# Altium project rpi fan control.PrjPcb
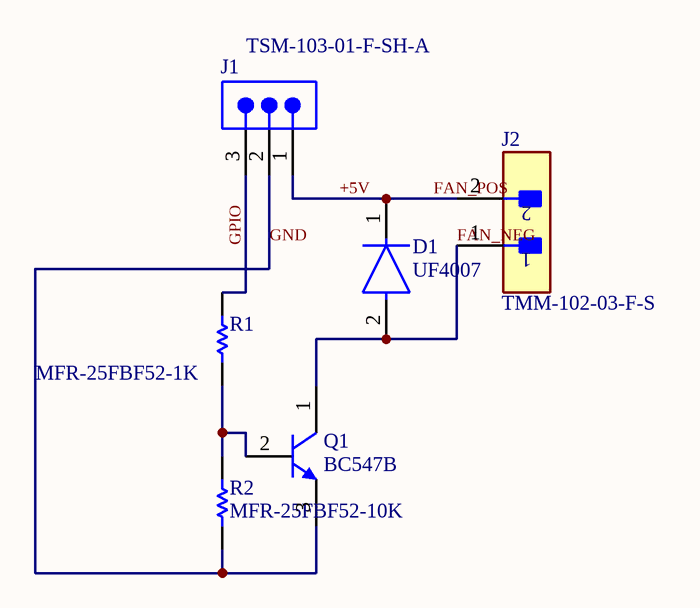
[diagram p0: rpi fan control.SchDoc]
1 sheet, 6 parts. Net scope: global (net labels, ports and power ports of the same name join across sheets).
Board file: PCB1.PcbDoc

## Sheet rpi fan control.SchDoc
size A; SheetNumber: 1; SheetTotal: 1

### Parts
D1  UF4007
J1  TSM-103-01-F-SH-A
J2  TMM-102-03-F-S
Q1  BC547B
R1  MFR-25FBF52-1K
R2  MFR-25FBF52-10K

### Nets
+5V: D1.1(C) J1.1 J2.2  [also labelled FAN_POS]
FAN_NEG: D1.2(A) J2.1 Q1.1(C)
GND: J1.2 Q1.3(E) R2.1
GPIO: J1.3 R1.1
NetQ1_2: Q1.2(B) R1.2 R2.2

### Library data of the parts
D1 = UF4007: Diode Ultra Fast Recovery Rectifier 1K Volt 1A 2-Pin DO-41 Tape and Reel; Manufacturer: onsemi; Manufacturer Lifecycle Status: ACTIVE; Value: 17pF; Element Configuration: Single; Forward Voltage: 1.4V; Max Forward Surge Current (Ifsm): 30A; Max Junction Temperature (Tj): 150°C; Max Power Dissipation: 2.08W; Max Repetitive Reverse Voltage (Vrrm): 1kV; Number of Elements: 1; Peak Reverse Current: 5µA; Polarity: Standard; Recovery Time: 75ns; Supplier: DigiKey; Supplier Part Number: UF4007CT-ND; Manufacturer Part Number: UF4007; RoHS: Compliant; Category: Rectifier Diodes; Stock: 17870; Pricing: 1=0.35, 10=0.218, 100=0.1797, 500=0.13446, 1000=0.11633, 2000=0.10752 (USD); Average Rectified Current: 1A; Case/Package: Axial; China RoHS: Non-Compliant; Contact Plating: Tin; Current: 1A; Current Rating: 1A; Forward Current: 1A; Height: 2.72mm; Lead Free: Lead Free; Length: 5.21mm; Lifecycle Status: Production; Max Operating Temperature: 150°C; Max Output current: 1A; Max Reverse Voltage (DC): 1kV; Max Surge Current: 30A; Min Operating Temperature: -65°C; Mounting Technology: Through Hole; Pins: 2; Number of Terminals: 2; Output Current: 1A; Packaging: Cut Tape; Peak Non-Repetitive Surge Current: 30A; Power Dissipation: 2.08W; Radiation Hardening: No; REACH SVHC: No; Reverse Recovery Time: 75ns; Reverse Standoff Voltage: 1kV; Reverse Voltage: 1kV; Schedule B: 8541100080, 8541100080|8541100080|8541100080|8541100080|8541100080; Voltage: 1kV; Voltage Rating (DC): 1kV; Weight: 4.535924g; Width: 2.72mm; ComponentLink1URL: https://datasheet.octopart.com:443/UF4007-onsemi-datasheet-180969923.pdf?src-supplier=IHS; ComponentLink1Description: https://datasheet.octopart.com:443/UF4007-onsemi-datasheet-180969923.pdf?src-supplier=IHS; ComponentLink2URL: https://datasheet.octopart.com:443/UF4007-onsemi-datasheet-181265948.pdf?src-supplier=IHS; ComponentLink2Description: https://datasheet.octopart.com:443/UF4007-onsemi-datasheet-181265948.pdf?src-supplier=IHS; ComponentLink3URL: https://datasheet.octopart.com:443/UF4007-Fairchild-Semiconductor-datasheet-182301099.pdf?src-supplier=IHS; ComponentLink3Description: https://datasheet.octopart.com:443/UF4007-Fairchild-Semiconductor-datasheet-182301099.pdf?src-supplier=IHS; ComponentLink4URL: https://datasheet.octopart.com:443/UF4007-ON-Semiconductor-datasheet-137256446.pdf?src-supplier=Farnell; ComponentLink4Description: https://datasheet.octopart.com:443/UF4007-ON-Semiconductor-datasheet-137256446.pdf?src-supplier=Farnell; ComponentLink5URL: https://datasheet.octopart.com:443/UF4007.-Fairchild-Semiconductor-datasheet-34433558.pdf?src-supplier=Farnell; ComponentLink5Description: https://datasheet.octopart.com:443/UF4007.-Fairchild-Semiconductor-datasheet-34433558.pdf?src-supplier=Farnell; ComponentLink6URL: https://datasheet.octopart.com:443/UF4007.-Fairchild-Semiconductor-datasheet-37002497.pdf?src-supplier=Farnell; ComponentLink6Description: https://datasheet.octopart.com:443/UF4007.-Fairchild-Semiconductor-datasheet-37002497.pdf?src-supplier=Farnell; ComponentLink7URL: https://datasheet.octopart.com:443/UF4007-Fairchild-Semiconductor-datasheet-41918660.pdf?src-supplier=Farnell; ComponentLink7Description: https://datasheet.octopart.com:443/UF4007-Fairchild-Semiconductor-datasheet-41918660.pdf?src-supplier=Farnell; ComponentLink8URL: https://sigma.octopart.com:443/138897246/technical_drawing/ON-Semiconductor-UF4007.pdf?src-supplier=Upverter; ComponentLink8Description: https://sigma.octopart.com:443/138897246/technical_drawing/ON-Semiconductor-UF4007.pdf?src-supplier=Upverter; ComponentLink9URL: https://datasheet.octopart.com:443/UF4007-ON-Semiconductor-datasheet-85608470.pdf?src-supplier=onsemi; ComponentLink9Description: https://datasheet.octopart.com:443/UF4007-ON-Semiconductor-datasheet-85608470.pdf?src-supplier=onsemi; ComponentLink10URL: https://datasheet.octopart.com:443/UF4007-ON-Semiconductor-datasheet-86698774.pdf?src-supplier=onsemi; ComponentLink10Description: https://datasheet.octopart.com:443/UF4007-ON-Semiconductor-datasheet-86698774.pdf?src-supplier=onsemi; ComponentLink11URL: https://datasheet.octopart.com:443/UF4007-ON-Semiconductor-datasheet-35217.pdf?src-supplier=Future+Electronics; ComponentLink11Description: https://datasheet.octopart.com:443/UF4007-ON-Semiconductor-datasheet-35217.pdf?src-supplier=Future+Electronics; ComponentLink12URL: https://datasheet.octopart.com:443/UF4007-ON-Semiconductor-datasheet-86693217.pdf?src-supplier=element14+APAC; ComponentLink12Description: https://datasheet.octopart.com:443/UF4007-ON-Semiconductor-datasheet-86693217.pdf?src-supplier=element14+APAC; ComponentLink13URL: https://datasheet.octopart.com:443/UF4007-Fairchild-Semiconductor-datasheet-38930020.pdf?src-supplier=element14+APAC; ComponentLink13Description: https://datasheet.octopart.com:443/UF4007-Fairchild-Semiconductor-datasheet-38930020.pdf?src-supplier=element14+APAC; ComponentLink14URL: https://datasheet.octopart.com:443/UF4007.-Fairchild-Semiconductor-datasheet-33335970.pdf?src-supplier=Newark; ComponentLink14Description: https://datasheet.octopart.com:443/UF4007.-Fairchild-Semiconductor-datasheet-33335970.pdf?src-supplier=Newark; ComponentLink15URL: https://datasheet.octopart.com:443/UF4007-ON-Semiconductor-datasheet-86693216.pdf?src-supplier=Newark; ComponentLink15Description: https://datasheet.octopart.com:443/UF4007-ON-Semiconductor-datasheet-86693216.pdf?src-supplier=Newark; ComponentLink16URL: https://datasheet.octopart.com:443/UF4007.-Fairchild-Semiconductor-datasheet-34214984.pdf?src-supplier=Newark; ComponentLink16Description: https://datasheet.octopart.com:443/UF4007.-Fairchild-Semiconductor-datasheet-34214984.pdf?src-supplier=Newark; ComponentLink17URL: https://datasheet.octopart.com:443/UF4007-Fairchild-Semiconductor-datasheet-38206202.pdf?src-supplier=Newark; ComponentLink17Description: https://datasheet.octopart.com:443/UF4007-Fairchild-Semiconductor-datasheet-38206202.pdf?src-supplier=Newark; ComponentLink18URL: https://datasheet.octopart.com:443/UF4007-Fairchild-Semiconductor-datasheet-38327715.pdf?src-supplier=Newark; ComponentLink18Description: https://datasheet.octopart.com:443/UF4007-Fairchild-Semiconductor-datasheet-38327715.pdf?src-supplier=Newark; ComponentLink19URL: https://datasheet.octopart.com:443/UF4007-Fairchild-Semiconductor-datasheet-41198808.pdf?src-supplier=Newark; ComponentLink19Description: https://datasheet.octopart.com:443/UF4007-Fairchild-Semiconductor-datasheet-41198808.pdf?src-supplier=Newark; ComponentLink20URL: https://sigma.octopart.com:443/17343399/technical_drawing/Fairchild-Semiconductor-UF4007..pdf?src-supplier=Fairchild+Semiconductor; ComponentLink20Description: https://sigma.octopart.com:443/17343399/technical_drawing/Fairchild-Semiconductor-UF4007..pdf?src-supplier=Fairchild+Semiconductor; ComponentLink21URL: https://datasheet.octopart.com:443/UF4007.-Fairchild-Semiconductor-datasheet-8212723.pdf?src-supplier=Jameco; ComponentLink21Description: https://datasheet.octopart.com:443/UF4007.-Fairchild-Semiconductor-datasheet-8212723.pdf?src-supplier=Jameco; ComponentLink22URL: https://datasheet.octopart.com:443/UF4007-ON-Semiconductor-datasheet-81456509.pdf?src-supplier=TME; ComponentLink22Description: https://datasheet.octopart.com:443/UF4007-ON-Semiconductor-datasheet-81456509.pdf?src-supplier=TME; ComponentLink23URL: https://datasheet.octopart.com:443/UF4007-Fairchild-Semiconductor-datasheet-62139681.pdf?src-supplier=iodParts+Technologies+Inc.; ComponentLink23Description: https://datasheet.octopart.com:443/UF4007-Fairchild-Semiconductor-datasheet-62139681.pdf?src-supplier=iodParts+Technologies+Inc.; ComponentLink24URL: http://sigma.octopart.com:80/150633077/rohs_statement/ON-Semiconductor-UF4007.pdf?src-supplier=Compliance+Statements; ComponentLink24Description: http://sigma.octopart.com:80/150633077/rohs_statement/ON-Semiconductor-UF4007.pdf?src-supplier=Compliance+Statements; ComponentLink25URL: http://sigma.octopart.com:80/17357661/reach_statement/Fairchild-Semiconductor-UF4007..pdf?src-supplier=Compliance+Statements; ComponentLink25Description: http://sigma.octopart.com:80/17357661/reach_statement/Fairchild-Semiconductor-UF4007..pdf?src-supplier=Compliance+Statements; ComponentLink26URL: http://sigma.octopart.com:80/17357662/materials_sheet/Fairchild-Semiconductor-UF4007..pdf?src-supplier=Compliance+Statements; ComponentLink26Description: http://sigma.octopart.com:80/17357662/materials_sheet/Fairchild-Semiconductor-UF4007..pdf?src-supplier=Compliance+Statements; ComponentLink27URL: http://sigma.octopart.com:80/33335989/reach_statement/Fairchild-Semiconductor-UF4007..pdf?src-supplier=Compliance+Statements; ComponentLink27Description: http://sigma.octopart.com:80/33335989/reach_statement/Fairchild-Semiconductor-UF4007..pdf?src-supplier=Compliance+Statements; ComponentLink28URL: http://sigma.octopart.com:80/33336027/materials_sheet/Fairchild-Semiconductor-UF4007..pdf?src-supplier=Compliance+Statements; ComponentLink28Description: http://sigma.octopart.com:80/33336027/materials_sheet/Fairchild-Semiconductor-UF4007..pdf?src-supplier=Compliance+Statements; ComponentLink29URL: http://sigma.octopart.com:80/reach_statement/ON-Semiconductor-company-79.pdf?src-supplier=Compliance+Statements; ComponentLink29Description: http://sigma.octopart.com:80/reach_statement/ON-Semiconductor-company-79.pdf?src-supplier=Compliance+Statements; ComponentLink30URL: http://sigma.octopart.com:80/rohs_statement/Fairchild-Semiconductor-company-11.pdf?src-supplier=Compliance+Statements; ComponentLink30Description: http://sigma.octopart.com:80/rohs_statement/Fairchild-Semiconductor-company-11.pdf?src-supplier=Compliance+Statements; ComponentLink31URL: http://sigma.octopart.com:80/rohs_statement/Fairchild-Semiconductor-company-10.pdf?src-supplier=Compliance+Statements; ComponentLink31Description: http://sigma.octopart.com:80/rohs_statement/Fairchild-Semiconductor-company-10.pdf?src-supplier=Compliance+Statements; ComponentLink32URL: http://sigma.octopart.com:80/reach_statement/Fairchild-Semiconductor-company-9.pdf?src-supplier=Compliance+Statements; ComponentLink32Description: http://sigma.octopart.com:80/reach_statement/Fairchild-Semiconductor-company-9.pdf?src-supplier=Compliance+Statements; ComponentLink33URL: https://octopart.com:443/opatz8j6/c1?t=eBWi3UUDGAOWFAqEZOdA6oGm2AXOLrg4WxmQ-w_-wOEfa_rUbLyaLzAMVTg5HN78kEsMDniv2Lbh3obgR6rwPPp8dABxS3d6o2eqYDO8o3gMdapd2Rz3U4Mz8uS4ECJ1wafDFTz_65bgIKqX5oG7KF8I7PBHVtR1XUau5h1NjsLN3h1M0Jzpf67G8G6cILdPvCoBrpMUjE6xXh3cMGaw-don7DWhZHICqt9ePpoxbFkS_y6cEvLn0fXWfL4eOTY-h66YpHbTIq3expYducgtuDtGA6p5zTq8haaiylq-T88WtL3tbmbvqedxrAFAZm-pmqbkhzdklXLIcmbo59_OYdA2n3lHF4hlmg&src-supplier=Compliance+Statements; ComponentLink33Description: https://octopart.com:443/opatz8j6/c1?t=eBWi3UUDGAOWFAqEZOdA6oGm2AXOLrg4WxmQ-w_-wOEfa_rUbLyaLzAMVTg5HN78kEsMDniv2Lbh3obgR6rwPPp8dABxS3d6o2eqYDO8o3gMdapd2Rz3U4Mz8uS4ECJ1wafDFTz_65bgIKqX5oG7KF8I7PBHVtR1XUau5h1NjsLN3h1M0Jzpf67G8G6cILdPvCoBrpMUjE6xXh3cMGaw-don7DWhZHICqt9ePpoxbFkS_y6cEvLn0fXWfL4eOTY-h66YpHbTIq3expYducgtuDtGA6p5zTq8haaiylq-T88WtL3tbmbvqedxrAFAZm-pmqbkhzdklXLIcmbo59_OYdA2n3lHF4hlmg&src-supplier=Compliance+Statements; ComponentLink34URL: https://octopart.com:443/opatz8j6/c1?t=a42jYeVJTD_Q6kJzO2WDpitc7EMEcKIEE4CmmV2eWJITApz43YWqo8baqaNLRCWKInwy-Kj54W9EQvVUslM8Jofv5nM44dMi8FQsB0icMd-Vvjmgv34zUkzXdyPtb0v_1mo3Km8R-PiTpVF7WkQnYyDRzI5yieaaMIcbHK5up9cBwLojC9EXvKKy8JZDDw2fEoGbyuxmXZkyHfgNwwzKXEmFCkViaW-vFHqss7ouPJRdbZ_Sf5Cy7QtFYnE8D4OuCrLObsJtEPkd95m40-WkOQk-n86xMyx9EqQ8aYfKqWrnbdJUEuOUyJ6iDZ2Mhpv8GXLnmFbPD6yJZ3HMrv7pfMPsDpiosL8lPLg&src-supplier=Compliance+Statements; ComponentLink34Description: https://octopart.com:443/opatz8j6/c1?t=a42jYeVJTD_Q6kJzO2WDpitc7EMEcKIEE4CmmV2eWJITApz43YWqo8baqaNLRCWKInwy-Kj54W9EQvVUslM8Jofv5nM44dMi8FQsB0icMd-Vvjmgv34zUkzXdyPtb0v_1mo3Km8R-PiTpVF7WkQnYyDRzI5yieaaMIcbHK5up9cBwLojC9EXvKKy8JZDDw2fEoGbyuxmXZkyHfgNwwzKXEmFCkViaW-vFHqss7ouPJRdbZ_Sf5Cy7QtFYnE8D4OuCrLObsJtEPkd95m40-WkOQk-n86xMyx9EqQ8aYfKqWrnbdJUEuOUyJ6iDZ2Mhpv8GXLnmFbPD6yJZ3HMrv7pfMPsDpiosL8lPLg&src-supplier=Compliance+Statements
J1 = TSM-103-01-F-SH-A: Conn Unshrouded Header HDR 3 POS 2.54mm Solder RA SMD Tube; Manufacturer: Samtec; Manufacturer Lifecycle Status: PRODUCTION; Gender: Male; Number of Contacts: 3; Supplier: Mouser; Supplier Part Number: 200-TSM10301FSHA; Manufacturer Part Number: TSM-103-01-F-SH-A; RoHS: Compliant; Category: Headers and Wire Housings; Stock: 346; Pricing: 1=1, 10=1, 50=0.832, 100=0.832, 1000=0.579, 10000=0.432 (USD); Contact Plating: Gold; Lead Free: Lead Free; Lifecycle Status: Production; Max Operating Temperature: 125°C; Min Operating Temperature: -55°C; Number of Rows: 1; Orientation: Horizontal; Packaging: Bulk; Pitch: 2.54mm; Radiation Hardening: No; Termination: Solder; ComponentLink1URL: https://datasheet.octopart.com:443/TSM-103-01-F-SH-A-Samtec-datasheet-97319594.pdf?src-supplier=Sager+Electronics; ComponentLink1Description: https://datasheet.octopart.com:443/TSM-103-01-F-SH-A-Samtec-datasheet-97319594.pdf?src-supplier=Sager+Electronics; ComponentLink2URL: https://datasheet.octopart.com:443/TSM-103-01-F-SH-A-Samtec-datasheet-155753699.pdf?src-supplier=Sager+Electronics; ComponentLink2Description: https://datasheet.octopart.com:443/TSM-103-01-F-SH-A-Samtec-datasheet-155753699.pdf?src-supplier=Sager+Electronics; ComponentLink3URL: https://datasheet.octopart.com:443/TSM-103-01-F-SH-A-Samtec-datasheet-151555687.pdf?src-supplier=Sager+Electronics; ComponentLink3Description: https://datasheet.octopart.com:443/TSM-103-01-F-SH-A-Samtec-datasheet-151555687.pdf?src-supplier=Sager+Electronics; ComponentLink4URL: https://datasheet.octopart.com:443/TSM-103-01-F-SH-A-Samtec-datasheet-12008796.pdf?src-supplier=Upverter; ComponentLink4Description: https://datasheet.octopart.com:443/TSM-103-01-F-SH-A-Samtec-datasheet-12008796.pdf?src-supplier=Upverter; ComponentLink5URL: https://datasheet.octopart.com:443/TSM-103-01-F-SH-A-Samtec-datasheet-10407325.pdf?src-supplier=Upverter; ComponentLink5Description: https://datasheet.octopart.com:443/TSM-103-01-F-SH-A-Samtec-datasheet-10407325.pdf?src-supplier=Upverter; ComponentLink6URL: https://sigma.octopart.com:443/97319599/technical_drawing/Samtec-TSM-103-01-F-SH-A.pdf?src-supplier=Samtec; ComponentLink6Description: https://sigma.octopart.com:443/97319599/technical_drawing/Samtec-TSM-103-01-F-SH-A.pdf?src-supplier=Samtec; ComponentLink7URL: https://datasheet.octopart.com:443/TSM-103-01-F-SH-A-Samtec-datasheet-141160580.pdf?src-supplier=Electro+Sonic; ComponentLink7Description: https://datasheet.octopart.com:443/TSM-103-01-F-SH-A-Samtec-datasheet-141160580.pdf?src-supplier=Electro+Sonic; ComponentLink8URL: https://datasheet.octopart.com:443/TSM-103-01-F-SH-A-Samtec-datasheet-179063997.pdf?src-supplier=JRH+Electronics; ComponentLink8Description: https://datasheet.octopart.com:443/TSM-103-01-F-SH-A-Samtec-datasheet-179063997.pdf?src-supplier=JRH+Electronics; ComponentLink9URL: https://datasheet.octopart.com:443/TSM-103-01-F-SH-A-Samtec-datasheet-116533474.pdf?src-supplier=Toby+Electronics; ComponentLink9Description: https://datasheet.octopart.com:443/TSM-103-01-F-SH-A-Samtec-datasheet-116533474.pdf?src-supplier=Toby+Electronics; ComponentLink10URL: https://datasheet.octopart.com/TSM-103-01-F-SH-A-Samtec-datasheet-68527555.pdf; ComponentLink10Description: https://datasheet.octopart.com/TSM-103-01-F-SH-A-Samtec-datasheet-68527555.pdf
J2 = TMM-102-03-F-S: Pin Header, Board-to-Board, Wire-to-Board, 2 mm, 1 Rows, 2 Contacts, Through Hole, TMM; Manufacturer: Samtec; Manufacturer Lifecycle Status: PRODUCTION; Current Rating: 3.2A; Gender: Male; Number of Contacts: 2; Pitch: 2mm; Voltage Rating: 281V; Voltage Rating (AC): 250V; Supplier: DigiKey; Supplier Part Number: TMM-102-03-F-S-ND; Manufacturer Part Number: TMM-102-03-F-S; RoHS: Compliant; Category: Headers and Wire Housings; Stock: 23; Pricing: 1=0.33, 50=0.26, 100=0.21, 500=0.18, 1000=0.156 (USD); Contact Material: Gold, Nickel; Contact Plating: Gold; Height: 5.68mm; Lead Free: Lead Free; Lifecycle Status: Production; Max Operating Temperature: 125°C; Min Operating Temperature: -55°C; Mounting Technology: Through Hole; Number of Rows: 1; Radiation Hardening: No; Termination: Solder; ComponentLink1URL: https://datasheet.octopart.com:443/TMM-102-03-F-S-Samtec-datasheet-151470502.pdf?src-supplier=Upverter; ComponentLink1Description: https://datasheet.octopart.com:443/TMM-102-03-F-S-Samtec-datasheet-151470502.pdf?src-supplier=Upverter; ComponentLink2URL: https://datasheet.octopart.com:443/TMM-102-03-F-S-Samtec-datasheet-97315812.pdf?src-supplier=Newark; ComponentLink2Description: https://datasheet.octopart.com:443/TMM-102-03-F-S-Samtec-datasheet-97315812.pdf?src-supplier=Newark; ComponentLink3URL: https://sigma.octopart.com:443/21558578/technical_drawing/Samtec-TMM-102-03-F-S.pdf?src-supplier=Samtec; ComponentLink3Description: https://sigma.octopart.com:443/21558578/technical_drawing/Samtec-TMM-102-03-F-S.pdf?src-supplier=Samtec; ComponentLink4URL: https://datasheet.octopart.com:443/TMM-102-03-F-S-Samtec-datasheet-86818372.pdf?src-supplier=Farnell; ComponentLink4Description: https://datasheet.octopart.com:443/TMM-102-03-F-S-Samtec-datasheet-86818372.pdf?src-supplier=Farnell; ComponentLink5URL: https://datasheet.octopart.com:443/TMM-102-03-F-S-Samtec-datasheet-129026051.pdf?src-supplier=Farnell; ComponentLink5Description: https://datasheet.octopart.com:443/TMM-102-03-F-S-Samtec-datasheet-129026051.pdf?src-supplier=Farnell; ComponentLink6URL: https://datasheet.octopart.com:443/TMM-102-03-F-S-Samtec-datasheet-140825053.pdf?src-supplier=Electro+Sonic; ComponentLink6Description: https://datasheet.octopart.com:443/TMM-102-03-F-S-Samtec-datasheet-140825053.pdf?src-supplier=Electro+Sonic; ComponentLink7URL: https://datasheet.octopart.com:443/TMM-102-03-F-S-Samtec-datasheet-175954262.pdf?src-supplier=JRH+Electronics; ComponentLink7Description: https://datasheet.octopart.com:443/TMM-102-03-F-S-Samtec-datasheet-175954262.pdf?src-supplier=JRH+Electronics; ComponentLink8URL: https://datasheet.octopart.com:443/TMM-102-03-F-S-Samtec-datasheet-151470503.pdf?src-supplier=Sager+Electronics; ComponentLink8Description: https://datasheet.octopart.com:443/TMM-102-03-F-S-Samtec-datasheet-151470503.pdf?src-supplier=Sager+Electronics; ComponentLink9URL: https://datasheet.octopart.com:443/TMM-102-03-F-S-Samtec-datasheet-141413159.pdf?src-supplier=Sager+Electronics; ComponentLink9Description: https://datasheet.octopart.com:443/TMM-102-03-F-S-Samtec-datasheet-141413159.pdf?src-supplier=Sager+Electronics; ComponentLink10URL: https://datasheet.octopart.com:443/TMM-102-03-F-S-Samtec-datasheet-159013293.pdf?src-supplier=Sager+Electronics; ComponentLink10Description: https://datasheet.octopart.com:443/TMM-102-03-F-S-Samtec-datasheet-159013293.pdf?src-supplier=Sager+Electronics; ComponentLink11URL: https://datasheet.octopart.com:443/TMM-102-03-F-S-Samtec-datasheet-116536297.pdf?src-supplier=Toby+Electronics; ComponentLink11Description: https://datasheet.octopart.com:443/TMM-102-03-F-S-Samtec-datasheet-116536297.pdf?src-supplier=Toby+Electronics; ComponentLink12URL: https://datasheet.octopart.com:443/TMM-102-03-F-S-Samtec-datasheet-136395496.pdf?src-supplier=Toby+Electronics; ComponentLink12Description: https://datasheet.octopart.com:443/TMM-102-03-F-S-Samtec-datasheet-136395496.pdf?src-supplier=Toby+Electronics; ComponentLink13URL: https://datasheet.octopart.com/TMM-102-03-F-S-Samtec-datasheet-10540225.pdf; ComponentLink13Description: https://datasheet.octopart.com/TMM-102-03-F-S-Samtec-datasheet-10540225.pdf
Q1 = BC547B: BC547 Series 45 V CE Breakdown .1 A NPN Epitaxial Silicon Transistor - TO-92; Manufacturer: onsemi; Manufacturer Lifecycle Status: LIFETIME; Manufacturer Package Identifier: MKT-ZA03DREV3; Collector Base Voltage (VCBO): 50V; Collector Emitter Breakdown Voltage: 45V; Collector Emitter Saturation Voltage: 250mV; Current: 1A; Current Rating: 100mA; Element Configuration: Single; Emitter Base Voltage (VEBO): 6V; Frequency: 300MHz; Gain Bandwidth Product: 100MHz; hFE Min: 200; Max Power Dissipation: 625mW; Number of Elements: 1; Power Dissipation: 500mW; Voltage: 40V; Supplier: Mouser; Supplier Part Number: 512-BC547B; Manufacturer Part Number: BC547B; RoHS: Compliant; Category: BJTs; Stock: 11439; Pricing: 1=0.38, 10=0.234, 50=0.234, 100=0.135, 1000=0.098, 10000=0.086 (USD); Case/Package: TO-92; China RoHS: Compliant; Collector Emitter Voltage (VCEO): 45V; Contact Plating: Copper, Silver, Tin; Height: 4.58mm; Lead Free: Lead Free; Length: 4.58mm; Lifecycle Status: Production; Max Breakdown Voltage: 45V; Max Collector Current: 100mA; Clock Frequency: 300MHz; Max Operating Temperature: 150°C; Min Operating Temperature: -65°C; Mounting Technology: Through Hole; Pins: 3; Number of Terminals: 3; Packaging: Bulk; Polarity: NPN; Radiation Hardening: No; REACH SVHC: Yes; Transition Frequency: 300MHz; Voltage Rating (DC): 45V; Weight: 200.005886mg; Width: 3.86mm; ComponentLink1URL: https://datasheet.octopart.com:443/BC547B-onsemi-datasheet-180957945.pdf?src-supplier=IHS; ComponentLink1Description: https://datasheet.octopart.com:443/BC547B-onsemi-datasheet-180957945.pdf?src-supplier=IHS; ComponentLink2URL: https://datasheet.octopart.com:443/BC547B-Fairchild-Semiconductor-datasheet-34208604.pdf?src-supplier=IHS; ComponentLink2Description: https://datasheet.octopart.com:443/BC547B-Fairchild-Semiconductor-datasheet-34208604.pdf?src-supplier=IHS; ComponentLink3URL: https://datasheet.octopart.com:443/BC547B-ON-Semiconductor-datasheet-11548122.pdf?src-supplier=Master+Electronics; ComponentLink3Description: https://datasheet.octopart.com:443/BC547B-ON-Semiconductor-datasheet-11548122.pdf?src-supplier=Master+Electronics; ComponentLink4URL: https://datasheet.octopart.com:443/BC547B-ON-Semiconductor-datasheet-26353630.pdf?src-supplier=Upverter; ComponentLink4Description: https://datasheet.octopart.com:443/BC547B-ON-Semiconductor-datasheet-26353630.pdf?src-supplier=Upverter; ComponentLink5URL: https://datasheet.octopart.com:443/BC547B-ON-Semiconductor-datasheet-574670.pdf?src-supplier=onsemi; ComponentLink5Description: https://datasheet.octopart.com:443/BC547B-ON-Semiconductor-datasheet-574670.pdf?src-supplier=onsemi; ComponentLink6URL: https://datasheet.octopart.com:443/BC547B-ON-Semiconductor-datasheet-151678557.pdf?src-supplier=onsemi; ComponentLink6Description: https://datasheet.octopart.com:443/BC547B-ON-Semiconductor-datasheet-151678557.pdf?src-supplier=onsemi; ComponentLink7URL: https://datasheet.octopart.com:443/BC547B-ON-Semiconductor-datasheet-86688575.pdf?src-supplier=onsemi; ComponentLink7Description: https://datasheet.octopart.com:443/BC547B-ON-Semiconductor-datasheet-86688575.pdf?src-supplier=onsemi; ComponentLink8URL: https://datasheet.octopart.com:443/BC547B-Fairchild-datasheet-7074.pdf?src-supplier=Fairchild+Semiconductor; ComponentLink8Description: https://datasheet.octopart.com:443/BC547B-Fairchild-datasheet-7074.pdf?src-supplier=Fairchild+Semiconductor; ComponentLink9URL: https://sigma.octopart.com:443/8329026/technical_drawing/Fairchild-Semiconductor-BC547B.pdf?src-supplier=Fairchild+Semiconductor; ComponentLink9Description: https://sigma.octopart.com:443/8329026/technical_drawing/Fairchild-Semiconductor-BC547B.pdf?src-supplier=Fairchild+Semiconductor; ComponentLink10URL: https://datasheet.octopart.com:443/BC547B-ON-Semiconductor-datasheet-105062517.pdf?src-supplier=Future+Electronics; ComponentLink10Description: https://datasheet.octopart.com:443/BC547B-ON-Semiconductor-datasheet-105062517.pdf?src-supplier=Future+Electronics; ComponentLink11URL: https://datasheet.octopart.com:443/BC547B-ON-Semiconductor-datasheet-86684081.pdf?src-supplier=element14+APAC; ComponentLink11Description: https://datasheet.octopart.com:443/BC547B-ON-Semiconductor-datasheet-86684081.pdf?src-supplier=element14+APAC; ComponentLink12URL: https://datasheet.octopart.com:443/BC547B-Fairchild-Semiconductor-datasheet-7537324.pdf?src-supplier=Farnell; ComponentLink12Description: https://datasheet.octopart.com:443/BC547B-Fairchild-Semiconductor-datasheet-7537324.pdf?src-supplier=Farnell; ComponentLink13URL: https://datasheet.octopart.com:443/BC547B-Fairchild-Semiconductor-datasheet-637514.pdf?src-supplier=Farnell; ComponentLink13Description: https://datasheet.octopart.com:443/BC547B-Fairchild-Semiconductor-datasheet-637514.pdf?src-supplier=Farnell; ComponentLink14URL: https://datasheet.octopart.com:443/BC547B-ON-Semiconductor-datasheet-6055.pdf?src-supplier=DigiKey; ComponentLink14Description: https://datasheet.octopart.com:443/BC547B-ON-Semiconductor-datasheet-6055.pdf?src-supplier=DigiKey; ComponentLink15URL: https://datasheet.octopart.com:443/BC547B-Fairchild-Semiconductor-datasheet-67878763.pdf?src-supplier=Newark; ComponentLink15Description: https://datasheet.octopart.com:443/BC547B-Fairchild-Semiconductor-datasheet-67878763.pdf?src-supplier=Newark; ComponentLink16URL: https://datasheet.octopart.com:443/BC547B-Fairchild-Semiconductor-datasheet-78861862.pdf?src-supplier=Newark; ComponentLink16Description: https://datasheet.octopart.com:443/BC547B-Fairchild-Semiconductor-datasheet-78861862.pdf?src-supplier=Newark; ComponentLink17URL: http://sigma.octopart.com:80/150605340/rohs_statement/ON-Semiconductor-BC547B.pdf?src-supplier=Compliance+Statements; ComponentLink17Description: http://sigma.octopart.com:80/150605340/rohs_statement/ON-Semiconductor-BC547B.pdf?src-supplier=Compliance+Statements; ComponentLink18URL: http://sigma.octopart.com:80/23426736/rohs_statement/Fairchild-Semiconductor-BC547B.pdf?src-supplier=Compliance+Statements; ComponentLink18Description: http://sigma.octopart.com:80/23426736/rohs_statement/Fairchild-Semiconductor-BC547B.pdf?src-supplier=Compliance+Statements; ComponentLink19URL: http://sigma.octopart.com:80/23426737/materials_sheet/Fairchild-Semiconductor-BC547B.pdf?src-supplier=Compliance+Statements; ComponentLink19Description: http://sigma.octopart.com:80/23426737/materials_sheet/Fairchild-Semiconductor-BC547B.pdf?src-supplier=Compliance+Statements; ComponentLink20URL: http://sigma.octopart.com:80/33052967/reach_statement/Fairchild-Semiconductor-BC547B.pdf?src-supplier=Compliance+Statements; ComponentLink20Description: http://sigma.octopart.com:80/33052967/reach_statement/Fairchild-Semiconductor-BC547B.pdf?src-supplier=Compliance+Statements; ComponentLink21URL: http://sigma.octopart.com:80/33053049/materials_sheet/Fairchild-Semiconductor-BC547B.pdf?src-supplier=Compliance+Statements; ComponentLink21Description: http://sigma.octopart.com:80/33053049/materials_sheet/Fairchild-Semiconductor-BC547B.pdf?src-supplier=Compliance+Statements; ComponentLink22URL: http://sigma.octopart.com:80/reach_statement/ON-Semiconductor-company-79.pdf?src-supplier=Compliance+Statements; ComponentLink22Description: http://sigma.octopart.com:80/reach_statement/ON-Semiconductor-company-79.pdf?src-supplier=Compliance+Statements; ComponentLink23URL: http://sigma.octopart.com:80/rohs_statement/Fairchild-Semiconductor-company-11.pdf?src-supplier=Compliance+Statements; ComponentLink23Description: http://sigma.octopart.com:80/rohs_statement/Fairchild-Semiconductor-company-11.pdf?src-supplier=Compliance+Statements; ComponentLink24URL: http://sigma.octopart.com:80/rohs_statement/Fairchild-Semiconductor-company-10.pdf?src-supplier=Compliance+Statements; ComponentLink24Description: http://sigma.octopart.com:80/rohs_statement/Fairchild-Semiconductor-company-10.pdf?src-supplier=Compliance+Statements; ComponentLink25URL: http://sigma.octopart.com:80/reach_statement/Fairchild-Semiconductor-company-9.pdf?src-supplier=Compliance+Statements; ComponentLink25Description: http://sigma.octopart.com:80/reach_statement/Fairchild-Semiconductor-company-9.pdf?src-supplier=Compliance+Statements; ComponentLink26URL: https://octopart.com:443/opatz8j6/c1?t=z1Cm58TvjfDnVkJc4wMswnGmmRTJDzeYF9EsSE00hou9P-Bvr35aBjPWUnrj7xLQPJ0EEiWibGEA3fB7Jd4gxdPwFjY9gxgKEFOX3KNwFM3AXK27BBmRxFJLRAbeL9huM4eF_BzaucWaZ5oH_B7VI0wTatK16QF8BUpwi4iOzOVRZxsU8kud4jZcZOsHcVqjtrhjYvNGnvOv9WC1UGFuOOPop9uNodWD8A_0Im96wIzSeYDMnMuvm6xKtCbznARafRNx4DuTEeROVIXADWlSpA40_kDdyzMPWeoGXjR5ubIFKSMPadLUI_1ObBUU7fQ9KvcnoU-wjeyn-ykV1fAg2NywK64STKM&src-supplier=Compliance+Statements; ComponentLink26Description: https://octopart.com:443/opatz8j6/c1?t=z1Cm58TvjfDnVkJc4wMswnGmmRTJDzeYF9EsSE00hou9P-Bvr35aBjPWUnrj7xLQPJ0EEiWibGEA3fB7Jd4gxdPwFjY9gxgKEFOX3KNwFM3AXK27BBmRxFJLRAbeL9huM4eF_BzaucWaZ5oH_B7VI0wTatK16QF8BUpwi4iOzOVRZxsU8kud4jZcZOsHcVqjtrhjYvNGnvOv9WC1UGFuOOPop9uNodWD8A_0Im96wIzSeYDMnMuvm6xKtCbznARafRNx4DuTEeROVIXADWlSpA40_kDdyzMPWeoGXjR5ubIFKSMPadLUI_1ObBUU7fQ9KvcnoU-wjeyn-ykV1fAg2NywK64STKM&src-supplier=Compliance+Statements; ComponentLink27URL: https://octopart.com:443/opatz8j6/c1?t=S0e_7dpjH7h1YXNhQAHqluPW7wVnsn4UES5gyO-U6dGwqcmsn-ASmDUVk4mxxf9zFcZdudcuvPTUE7hLz6Qn8RPa2wFpRbsLqtZVzlxBbfdyBhzUbJyhe5NgWiysk-yCGglxstXnn5vf_qCXHFYQBBS6qUEnxGngjtFgloc19GJ3fPUMa6BXnkJHbj1wVLLpgEdhodHl0P7rUSzjG_q9rjs0vGrkIjMGBlZL84BZMGEfg7kTtCLeOwZYN4rMJ3gn9T5iBLUvhMQSkcKCSlilNqP5_wsT1s2LMs--5ULeOQv32F0aYyq-Y-mtsD_sTZoamkU0raFsG85w_q4-zBK4kxB_Ar7H3Q&src-supplier=Compliance+Statements; ComponentLink27Description: https://octopart.com:443/opatz8j6/c1?t=S0e_7dpjH7h1YXNhQAHqluPW7wVnsn4UES5gyO-U6dGwqcmsn-ASmDUVk4mxxf9zFcZdudcuvPTUE7hLz6Qn8RPa2wFpRbsLqtZVzlxBbfdyBhzUbJyhe5NgWiysk-yCGglxstXnn5vf_qCXHFYQBBS6qUEnxGngjtFgloc19GJ3fPUMa6BXnkJHbj1wVLLpgEdhodHl0P7rUSzjG_q9rjs0vGrkIjMGBlZL84BZMGEfg7kTtCLeOwZYN4rMJ3gn9T5iBLUvhMQSkcKCSlilNqP5_wsT1s2LMs--5ULeOQv32F0aYyq-Y-mtsD_sTZoamkU0raFsG85w_q4-zBK4kxB_Ar7H3Q&src-supplier=Compliance+Statements
R1 = MFR-25FBF52-1K: Fixed Resistor, Metal Film, 0.25W, 1000ohm, 250V, 1% +/-Tol, 100ppm/Cel, Through Hole Mount; Manufacturer: Yageo Group; Lead Diameter: 550µm; Lead Length: 28mm; Max Power Dissipation: 250mW; Value: 1kΩ; Temperature Coefficient: 100ppm/°C; Voltage Rating (DC): 200V; Supplier: Avnet; Supplier Part Number: MFR-25FBF52-1K; Manufacturer Part Number: MFR-25FBF52-1K; RoHS: Compliant; Category: Through-Hole Resistors; Stock: 664; Pricing: 1=0.09457, 2=0.03413, 4=0.03395, 8=0.03378, 16=0.02208 (USD); Case/Package: Axial; China RoHS: Compliant; Composition: Metal Film; Diameter: 2.4mm; Lead Free: Lead Free; Length: 6.2992mm; Lifecycle Status: Production; Max Operating Temperature: 155°C; Min Operating Temperature: -55°C; Mounting Technology: Through Hole; Pins: 2; Number of Terminals: 2; Number of Terminations: 2; Packaging: Bulk; Power Dissipation: 250mW; Power Rating: 250mW; REACH SVHC: Yes; Schedule B: 8533210090, 8533210090|8533210090|8533210090|8533210090|8533210090|8533210090|8533210090|8533210090|8533210090|8533210090|8533210090|8533210090|8533210090|8533210090|8533210090|8533210090|8533210090|8533210090|8533210090|8533210090|8533210090|8533210090|8533210090|85; Termination: Axial; Tolerance: 1%; Voltage Rating: 250V; Width: 6.3mm; Working Voltage: 250V; ComponentLink1URL: https://datasheet.octopart.com:443/MFR-25FBF52-1K-Yageo-datasheet-175665672.pdf?src-supplier=IHS; ComponentLink1Description: https://datasheet.octopart.com:443/MFR-25FBF52-1K-Yageo-datasheet-175665672.pdf?src-supplier=IHS; ComponentLink2URL: https://datasheet.octopart.com/MFR-25FBF52-1K-Yageo-datasheet-28066692.pdf; ComponentLink2Description: https://datasheet.octopart.com/MFR-25FBF52-1K-Yageo-datasheet-28066692.pdf; ComponentLink3URL: https://datasheet.octopart.com:443/MFR-25FBF52-1K-Yageo-datasheet-12510115.pdf?src-supplier=Upverter; ComponentLink3Description: https://datasheet.octopart.com:443/MFR-25FBF52-1K-Yageo-datasheet-12510115.pdf?src-supplier=Upverter; ComponentLink4URL: https://datasheet.octopart.com:443/MFR-25FBF52-1K-Yageo-datasheet-165493774.pdf?src-supplier=Future+Electronics; ComponentLink4Description: https://datasheet.octopart.com:443/MFR-25FBF52-1K-Yageo-datasheet-165493774.pdf?src-supplier=Future+Electronics; ComponentLink5URL: https://datasheet.octopart.com:443/MFR-25FBF52-1K-Yageo-datasheet-155367622.pdf?src-supplier=Future+Electronics; ComponentLink5Description: https://datasheet.octopart.com:443/MFR-25FBF52-1K-Yageo-datasheet-155367622.pdf?src-supplier=Future+Electronics; ComponentLink6URL: https://datasheet.octopart.com:443/MFR-25FBF52-1K-Yageo-datasheet-17233670.pdf?src-supplier=Future+Electronics; ComponentLink6Description: https://datasheet.octopart.com:443/MFR-25FBF52-1K-Yageo-datasheet-17233670.pdf?src-supplier=Future+Electronics; ComponentLink7URL: https://datasheet.octopart.com:443/MFR-25FBF52-1K-Yageo-datasheet-137700554.pdf?src-supplier=Future+Electronics; ComponentLink7Description: https://datasheet.octopart.com:443/MFR-25FBF52-1K-Yageo-datasheet-137700554.pdf?src-supplier=Future+Electronics; ComponentLink8URL: http://sigma.octopart.com:80/rohs_statement/Yageo-company-2.pdf?src-supplier=Compliance+Statements; ComponentLink8Description: http://sigma.octopart.com:80/rohs_statement/Yageo-company-2.pdf?src-supplier=Compliance+Statements; ComponentLink9URL: http://sigma.octopart.com:80/conflict_mineral_statement/Yageo-company-3.pdf?src-supplier=Compliance+Statements; ComponentLink9Description: http://sigma.octopart.com:80/conflict_mineral_statement/Yageo-company-3.pdf?src-supplier=Compliance+Statements
R2 = MFR-25FBF52-10K: Fixed Resistor, Metal Film, 0.25W, 10000ohm, 250V, 1% +/-Tol, 100ppm/Cel, Through Hole Mount; Manufacturer: Yageo Group; Lead Diameter: 550µm; Lead Length: 28mm; Max Power Dissipation: 250mW; Value: 10kΩ; Temperature Coefficient: 100ppm/°C; Voltage Rating (DC): 200V; Supplier: DigiKey; Supplier Part Number: 10.0KXBK-ND; Manufacturer Part Number: MFR-25FBF52-10K; RoHS: Compliant; Category: Through-Hole Resistors; Stock: 82157; Pricing: 1=0.1, 10=0.039, 25=0.0328, 50=0.0286, 100=0.0251, 250=0.02128, 500=0.0189, 1000=0.01685, 5000=0.01321 (USD); Case/Package: Axial; China RoHS: Compliant; Composition: Metal Film; Diameter: 2.4mm; Lead Free: Lead Free; Length: 6.2992mm; Lifecycle Status: Production; Max Operating Temperature: 155°C; Military Standard: Not; Min Operating Temperature: -55°C; Pins: 2; Number of Terminals: 2; Number of Terminations: 2; Packaging: Bulk; Power Dissipation: 250mW; Power Rating: 250mW; REACH SVHC: Yes; Schedule B: 8533210090, 8533210090|8533210090|8533210090|8533210090|8533210090; Termination: Axial; Tolerance: 1%; Voltage Rating: 250V; Working Voltage: 250V; ComponentLink1URL: https://datasheet.octopart.com:443/MFR-25FBF52-10K-Yageo-datasheet-175665672.pdf?src-supplier=IHS; ComponentLink1Description: https://datasheet.octopart.com:443/MFR-25FBF52-10K-Yageo-datasheet-175665672.pdf?src-supplier=IHS; ComponentLink2URL: https://datasheet.octopart.com/MFR-25FBF52-10K-Yageo-datasheet-28066692.pdf; ComponentLink2Description: https://datasheet.octopart.com/MFR-25FBF52-10K-Yageo-datasheet-28066692.pdf; ComponentLink3URL: https://datasheet.octopart.com:443/MFR-25FBF52-10K-Yageo-datasheet-12510115.pdf?src-supplier=Upverter; ComponentLink3Description: https://datasheet.octopart.com:443/MFR-25FBF52-10K-Yageo-datasheet-12510115.pdf?src-supplier=Upverter; ComponentLink4URL: https://datasheet.octopart.com:443/MFR-25FBF52-10K-Yageo-datasheet-175423670.pdf?src-supplier=Newark; ComponentLink4Description: https://datasheet.octopart.com:443/MFR-25FBF52-10K-Yageo-datasheet-175423670.pdf?src-supplier=Newark; ComponentLink5URL: https://datasheet.octopart.com:443/MFR-25FBF52-10K-Yageo-datasheet-165493774.pdf?src-supplier=Future+Electronics; ComponentLink5Description: https://datasheet.octopart.com:443/MFR-25FBF52-10K-Yageo-datasheet-165493774.pdf?src-supplier=Future+Electronics; ComponentLink6URL: https://datasheet.octopart.com:443/MFR-25FBF52-10K-Yageo-datasheet-155367622.pdf?src-supplier=Future+Electronics; ComponentLink6Description: https://datasheet.octopart.com:443/MFR-25FBF52-10K-Yageo-datasheet-155367622.pdf?src-supplier=Future+Electronics; ComponentLink7URL: https://datasheet.octopart.com:443/MFR-25FBF52-10K-Yageo-datasheet-17233670.pdf?src-supplier=Future+Electronics; ComponentLink7Description: https://datasheet.octopart.com:443/MFR-25FBF52-10K-Yageo-datasheet-17233670.pdf?src-supplier=Future+Electronics; ComponentLink8URL: https://datasheet.octopart.com:443/MFR-25FBF52-10K-Yageo-datasheet-8324301.pdf?src-supplier=Future+Electronics; ComponentLink8Description: https://datasheet.octopart.com:443/MFR-25FBF52-10K-Yageo-datasheet-8324301.pdf?src-supplier=Future+Electronics; ComponentLink9URL: http://sigma.octopart.com:80/rohs_statement/Yageo-company-2.pdf?src-supplier=Compliance+Statements; ComponentLink9Description: http://sigma.octopart.com:80/rohs_statement/Yageo-company-2.pdf?src-supplier=Compliance+Statements; ComponentLink10URL: http://sigma.octopart.com:80/conflict_mineral_statement/Yageo-company-3.pdf?src-supplier=Compliance+Statements; ComponentLink10Description: http://sigma.octopart.com:80/conflict_mineral_statement/Yageo-company-3.pdf?src-supplier=Compliance+Statements